# EAGLE design rfid_module (EAGLE 6.1)
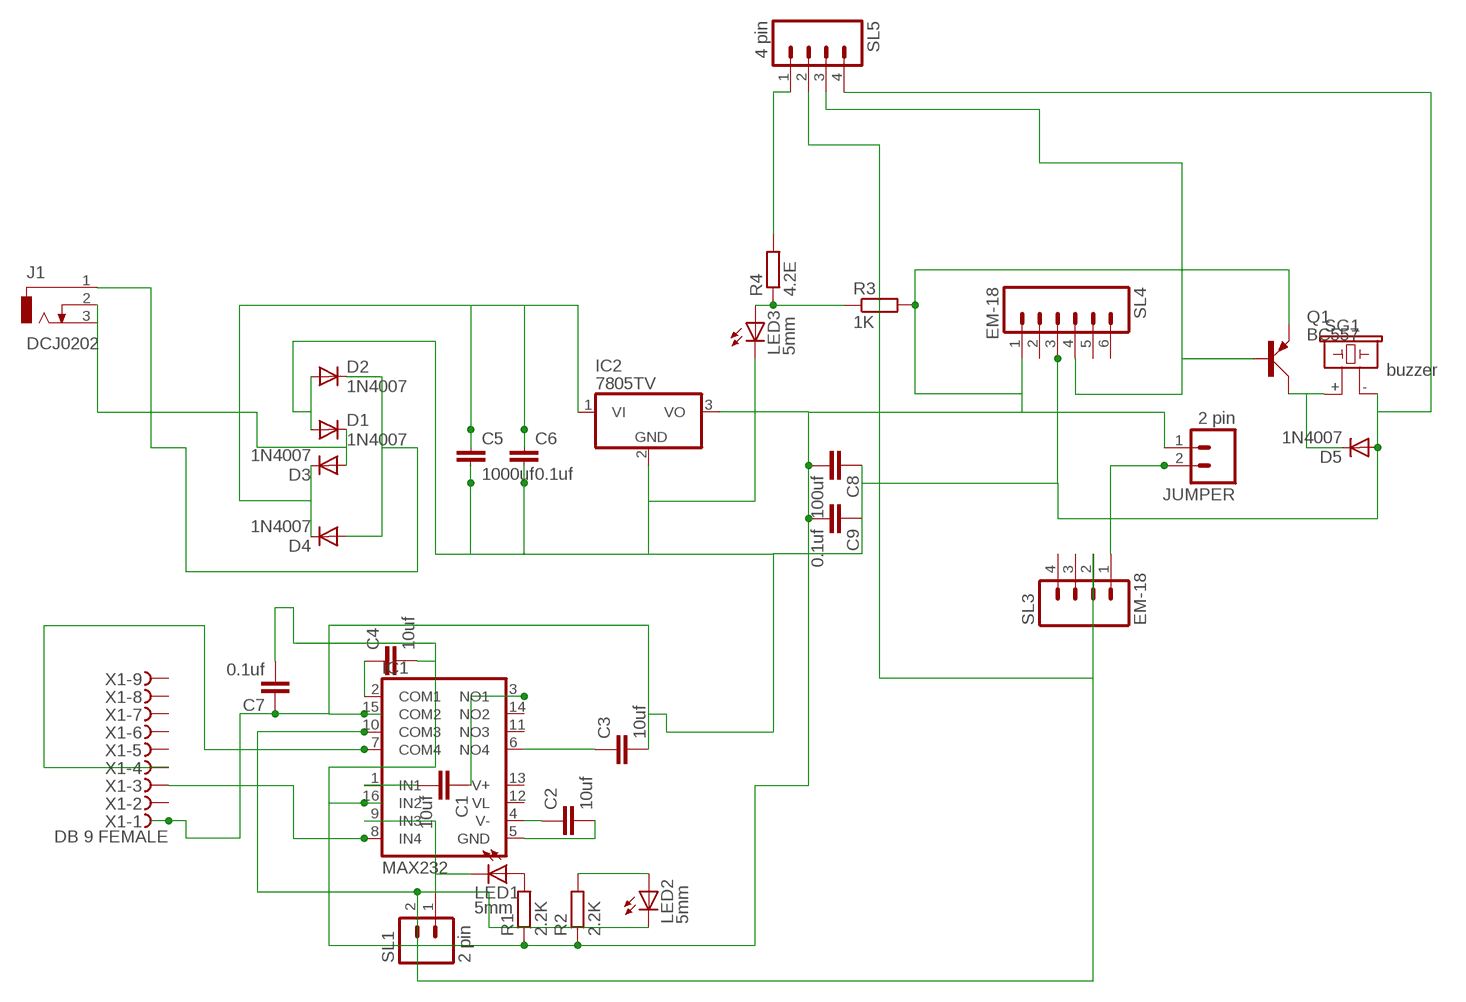
[diagram p0: schematic, sheet 1]

## Parts
C1  10uf  C2,5-3  [C2.5-3]
C2  10uf  C2,5-3  [C2.5-3]
C3  10uf  C2,5-3  [C2.5-3]
C4  10uf  C2,5-3  [C2.5-3]
C5  1000uf  C5/7.2  [C5B7.2]
C6  0.1uf  C2,5-3  [C2.5-3]
C7  0.1uf  C2,5-3  [C2.5-3]
C8  100uf  C2,5-3  [C2.5-3]
C9  0.1uf  C2,5-3  [C2.5-3]
D1  1N4007  1N4004  [DO41-10]
D2  1N4007  1N4004  [DO41-10]
D3  1N4007  1N4004  [DO41-10]
D4  1N4007  1N4004  [DO41-10]
D5  1N4007  1N4004  [DO41-10]
IC1  MAX232  MAX313EPE  [DIL16]
IC2  7805TV  [TO220V]
J1  DCJ0202  [DCJ0202]
JUMPER  2 pin  M02  [02P]
LED1  5mm  LED5MM  [LED5MM]
LED2  5mm  LED5MM  [LED5MM]
LED3  5mm  LED5MM  [LED5MM]
Q1  BC557  [SOT54A]
R1  2.2K  R-EU_0204/7  [0204/7]
R2  2.2K  R-EU_0204/7  [0204/7]
R3  1K  R-EU_0204/7  [0204/7]
R4  4.2E  R-EU_0204/7  [0204/7]
SG1  buzzer  F/CM12P  [F/CM12P]
SL1  2 pin  M02  [02P]
SL3  EM-18  M04  [04P]
SL4  EM-18  M06  [06P]
SL5  4 pin  M04  [04P]
X1  DB 9 FEMALE  D-SUB9-H2M09ST  [H2M09ST]

## Nets
N$1: C1.2 IC1.1(IN1)
N$2: C1.1 IC1.3(NO1)
N$3: C2.1 IC1.4(V-)
N$4: C2.2 IC1.5(GND)
N$5: C3.1 IC1.6(NO4)
N$6: C4.2 C7.2 C8.2 C9.2 IC1.16(IN2) IC2.3(VO) JUMPER.1 Q1.E R1.1 R2.1 R3.2 SL4.1
N$7: C4.1 IC1.2(COM1)
N$8: IC1.9(IN3) LED1.K(C) SL1.1
N$9: IC1.8(IN4) X1.3
N$10: IC1.7(COM4) X1.4
N$11: IC1.10(COM3) LED2.K(C) SL1.2 SL3.2 SL5.2
N$12: LED2.A R2.2
N$13: C3.2 C5.2 C6.2 C7.1 C8.1 C9.1 D1.A D2.A D5.A IC1.15(COM2) IC2.2(GND) LED3.K(C) SG1.- SL4.3 SL5.4 X1.1
N$14: C5.1 C6.1 D3.C D4.C IC2.1(VI)
N$15: D2.C D4.A J1.1
N$16: LED1.A R1.2
N$17: D5.C Q1.C SG1.+
N$18: D1.C D3.A J1.2 J1.3
N$19: Q1.B SL4.4 SL5.3
N$20: JUMPER.2 SL3.1
N$21: LED3.A R3.1 R4.1
N$22: R4.2 SL5.1
Unconnected: IC1.11(NO3) IC1.14(NO2) SL3.3 SL3.4 SL4.2 SL4.5 SL4.6 X1.2 X1.5 X1.6 X1.7 X1.8 X1.9

## Power pins joined to a net without a drawn wire
V+: IC1.13(V+)
VL: IC1.12(VL)

## Library data of the parts
C1-C9 = capacitor-wima:C: CAPACITOR naming: grid - package width
D1-D5 = diode:1N4004: DIODE general purpose rectifier, 1 A
IC1 = maxim:MAX313: 10?, Quad, SPST, CMOS Analog Switches Source: http://datasheets.maxim-ic.com/en/ds/MAX312-MAX314.pdf; MPN: MAX313EPE+; OC_FARNELL: unknown; OC_NEWARK: 99K3220
IC2 = linear:78*: Positive VOLTAGE REGULATOR Source: http://cache.national.com/ds/LM/LM78L05.pdf http://www.fairchildsemi.com/ds/LM/LM7805.pdf
J1 = con-jack:DCJ0202: DC POWER JACK Source: DCJ0202.pdf; OC_FARNELL: unknown; OC_NEWARK: unknown
JUMPER SL1 = con-amp-quick:M02: AMP QUICK CONNECTOR; OC_FARNELL: unknown; OC_NEWARK: unknown
LED1-LED3 = led:LED: LED OSRAM: - CHIPLED LG R971, LG N971, LY N971, LG Q971, LY Q971, LO R971, LY R971 LH N974, LH R974 LS Q976, LO Q976, LY Q976 LO Q996 - Hyper CHIPLED LW Q18S LB Q993, LB Q99A, LB R99A - SideLED LS A670, LO A670, LY A670, LG A670, LP A670 LB A673, LV A673, LT A673, LW A673 LH A674 LY A675 LS A676, LA A676, LO A676, LY A676, LW A676 LS A679, LY A679, LG A679 - Hyper Micro SIDELED® LS Y876, LA Y876, LO Y876, LY Y876 LT Y87S - SmartLED LW L88C, LW L88S LB L89C, LB L89S, LG L890 LS L89K, LO L89K, LY L89K LS L896, LA L896, LO L896, LY L896 - TOPLED LS T670, LO T670, LY T670, LG T670, LP T670 LSG T670, LSP T670, LSY T670, LOP T670, LYG T670 LG T671, LOG T671, LSG T671 LB T673, LV T673, LT T673, LW T673 LH T674 LS T676, LA T676, LO T676, LY T676, LB T676, LH T676, LSB T676, LW T676 LB T67C, LV T67C, LT T67C, LS T67K, LO T67K, LY T67K, LW E67C LS E67B, LA E67B, LO E67B, LY E67B, LB E67C, LV E67C, LT E67C LW T67C LS T679, LY T679, LG T679 LS T770, LO T770, LY T770, LG T770, LP T770 LB T773, LV T773, LT T773, LW T773 LH T774 LS E675, LA E675, LY E675, LS T675 LS T776, LA T776, LO T776, LY T776, LB T776 LHGB T686 LT T68C, LB T68C - Hyper Mini TOPLED® LB M676 - Mini TOPLED Santana® LG M470 LS M47K, LO M47K, LY M47K Source: http://www.osram.convergy.de LUXEON: - LUMILED® LXK2-PW12-R00, LXK2-PW12-S00, LXK2-PW14-U00, LXK2-PW14-V00 LXK2-PM12-R00, LXK2-PM12-S00, LXK2-PM14-U00 LXK2-PE12-Q00, LXK2-PE12-R00, LXK2-PE12-S00, LXK2-PE14-T00, LXK2-PE14-U00 LXK2-PB12-K00, LXK2-PB12-L00, LXK2-PB12-M00, LXK2-PB14-N00, LXK2-PB14-P00, LXK2-PB14-Q00 LXK2-PR12-L00, LXK2-PR12-M00, LXK2-PR14-Q00, LXK2-PR14-R00 LXK2-PD12-Q00, LXK2-PD12-R00, LXK2-PD12-S00 LXK2-PH12-R00, LXK2-PH12-S00 LXK2-PL12-P00, LXK2-PL12-Q00, LXK2-PL12-R00 Source: www.luxeon.com KINGBRIGHT: KA-3528ASYC Source: www.kingbright.com
Q1 = transistor-small-signal:BC557: PNP TRANSISTOR
R1-R4 = rcl:R-EU_: RESISTOR, European symbol
SG1 = buzzer:F/CM12P: BUZZER Source: Buerklin; OC_FARNELL: unknown; OC_NEWARK: unknown
SL3 SL5 = con-amp-quick:M04: AMP QUICK CONNECTOR; OC_FARNELL: unknown; OC_NEWARK: unknown
SL4 = con-amp-quick:M06: AMP QUICK CONNECTOR; OC_FARNELL: unknown; OC_NEWARK: unknown
X1 = con-thomas-betts:D-SUB9-: D-Subminiatur Connector Source: Electronioc Interconnects European Edition 1998; OC_FARNELL: unknown; OC_NEWARK: unknown

## Board
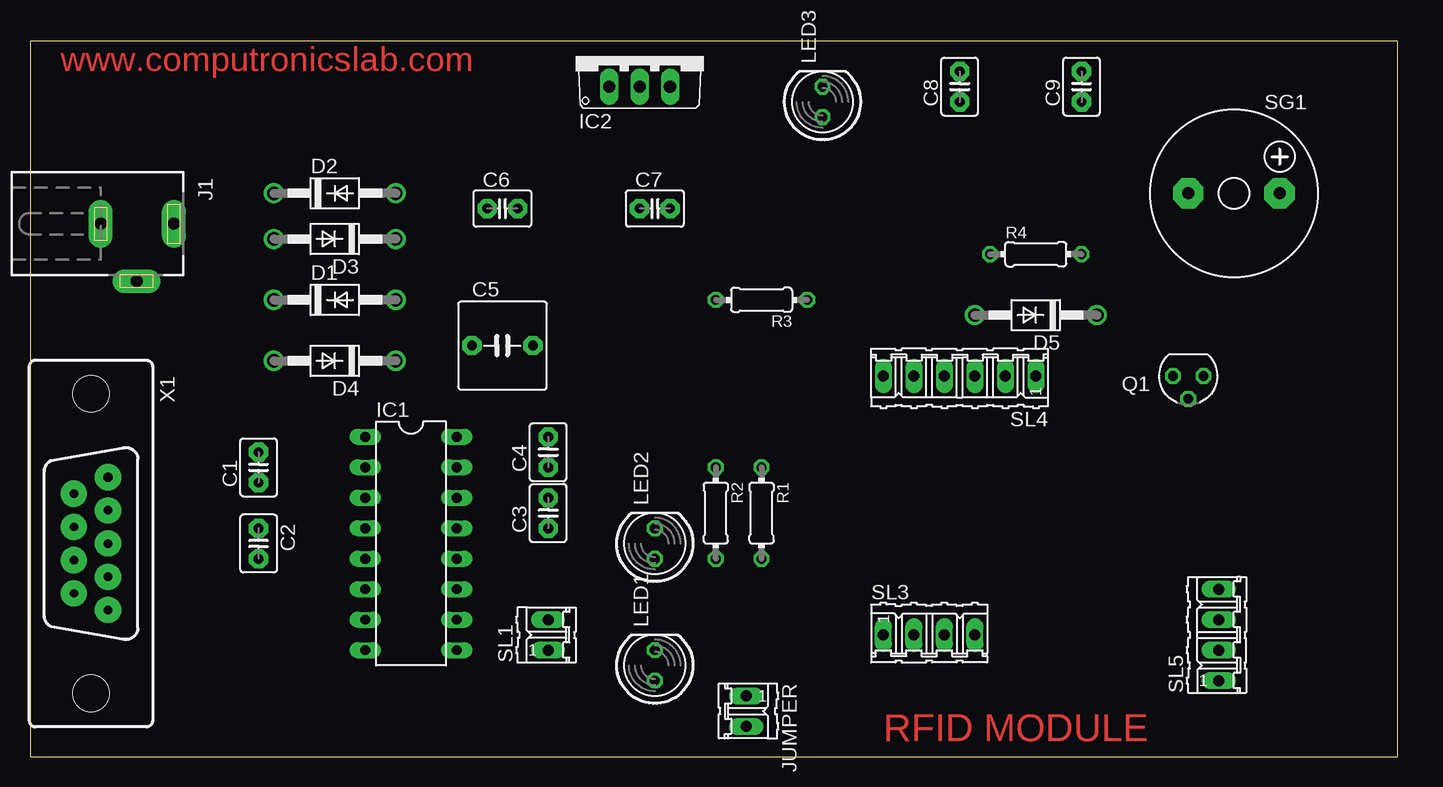
[diagram p1: board, top side]
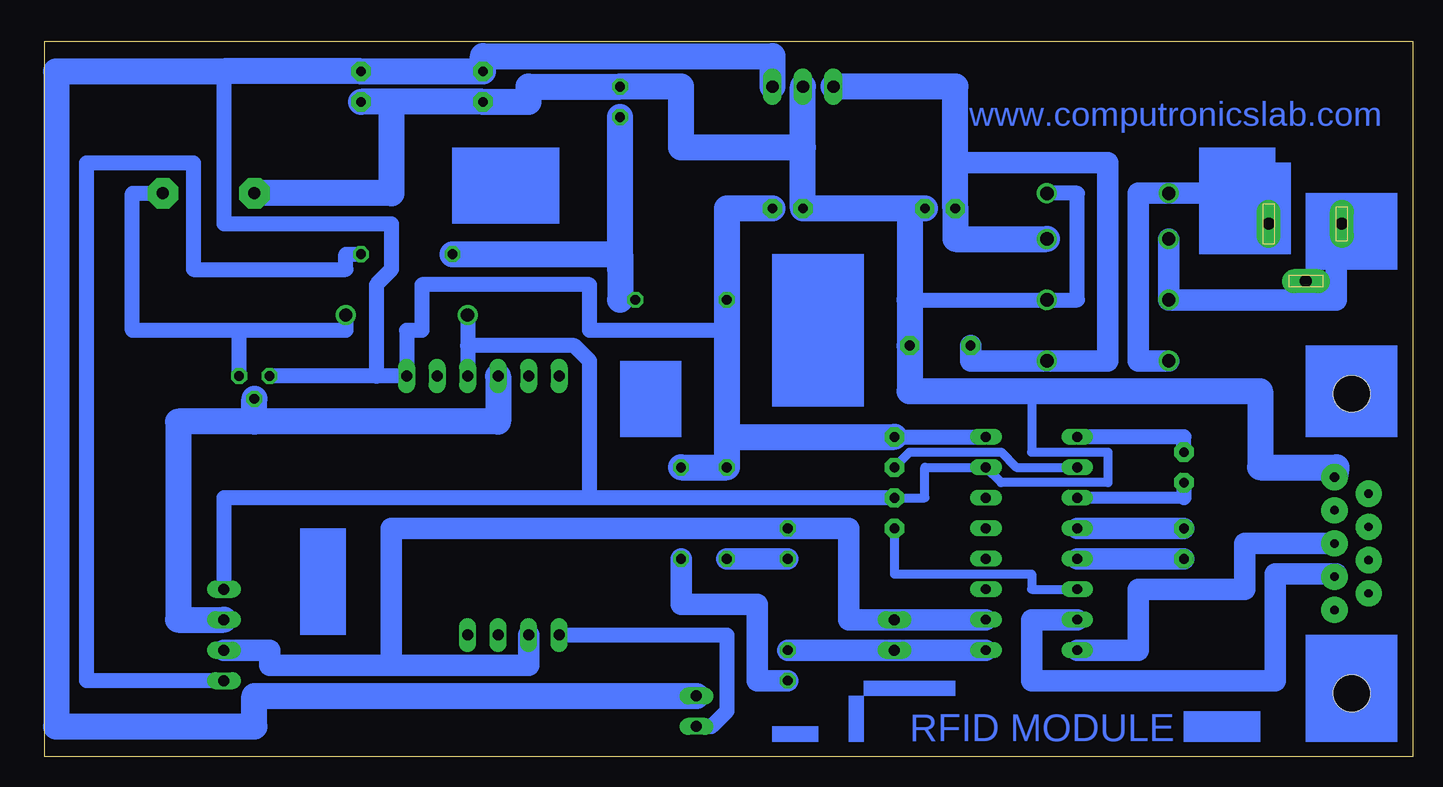
[diagram p2: board, bottom side, seen from below]

Size 113.97 x 59.68 mm. Coordinates in mm from the lower left corner, seen from the top.
Outline: 0,0 113.97,0 113.97,59.68 0,59.68 0,0
Copper layers (1*16): Top 0.035mm / dielectric 1.5mm / Bottom 0.035mm
Design rules: minimum track width 30mil, minimum drill 24mil, track to track 8mil, track to pad 8mil, pad to pad 8mil, via to via 8mil, smd to smd 8mil, copper to edge 40mil, drill to drill 8mil, minimum pad ring 10mil, minimum via ring 8mil, stop-mask expansion 4mil, vias tented up to drill 0mil, thermal gap 10mil

### Footprints (pad centres in the part's own frame; a part is rotated, then mirrored left to right if it is on the bottom)
C2.5-3 = drill 0.813 pad 1.6 octagon: 1 -1.27,0; 2 1.27,0
C5B7.2 = drill 0.813 pad 1.6 octagon: 1 -2.54,0; 2 2.54,0
DO41-10 = drill 1.118: A 5.08,0; C -5.08,0
DIL16 = drill 0.813 long: 1 -8.89,-3.81; 2 -6.35,-3.81; 3 -3.81,-3.81; 4 -1.27,-3.81; 5 1.27,-3.81; 6 3.81,-3.81; 7 6.35,-3.81; 8 8.89,-3.81; 9 8.89,3.81; 10 6.35,3.81; 11 3.81,3.81; 12 1.27,3.81; 13 -1.27,3.81; 14 -3.81,3.81; 15 -6.35,3.81; 16 -8.89,3.81
TO220V = drill 1.016 long: 1 -2.54,-2.54; 2 0,-2.54; 3 2.54,-2.54
DCJ0202 = drill 1 pad 2 long: 1 0,3.1; 2 4.8,0; 3 0,-3
02P = drill 0.914 long: 1 -1.27,0; 2 1.27,0
LED5MM = drill 0.813 octagon: A -1.27,0; K 1.27,0
SOT54A = drill 0.813 octagon: B 0,1.905; C -1.27,0; E 1.27,0
0204/7 = drill 0.813 octagon: 1 -3.81,0; 2 3.81,0
F/CM12P = drill 1.016 pad 2.54 octagon: + 3.81,0; - -3.81,0
04P = drill 0.914 long: 1 -3.81,0; 2 -1.27,0; 3 1.27,0; 4 3.81,0
06P = drill 0.914 long: 1 -6.35,0; 2 -3.81,0; 3 -1.27,0; 4 1.27,0; 5 3.81,0; 6 6.35,0
H2M09ST = drill 0.8 pad 2.184: 1 -5.537,1.422 | drill 0.7 pad 2.184: 2 -2.769,1.422; 3 0,1.422; 4 2.769,1.422; 5 5.537,1.422; 6 -4.153,-1.422; 7 -1.384,-1.422; 8 1.384,-1.422; 9 4.153,-1.422 | hole 3.048: -12.497,0; 12.497,0

### Placement (x,y rotation side)
C1  19.05,24.13 90 top
C2  19.05,17.78 270 top
C3  43.18,20.32 90 top
C4  43.18,25.4 90 top
C5  39.37,34.29 0 top
C6  39.37,45.72 0 top
C7  52.07,45.72 0 top
C8  77.47,55.88 90 top
C9  87.63,55.88 90 top
D1  25.4,38.1 0 top
D2  25.4,46.99 0 top
D3  25.4,43.18 180 top
D4  25.4,33.02 180 top
D5  83.82,36.83 180 top
IC1  31.75,17.78 270 top
IC2  50.8,58.42 0 top
J1  8.89,44.45 270 top
JUMPER  59.69,3.81 270 top
LED1  52.07,7.62 90 top
LED2  52.07,17.78 90 top
LED3  66.04,54.61 90 top
Q1  96.52,31.75 180 top
R1  60.96,20.32 270 top
R2  57.15,20.32 270 top
R3  60.96,38.1 180 top
R4  83.82,41.91 0 top
SG1  100.33,46.99 0 top
SL1  43.18,10.16 90 top
SL3  74.93,10.16 0 top
SL4  77.47,31.75 180 top
SL5  99.06,10.16 90 top
X1  5.08,17.78 270 top

### Tracks (layer width: path | path; a pad name or v marks a point on that pad's centre or on a via)
N$1
  Bottom 1.27: IC1.1 19.05,26.67 C1.2
N$2
  Bottom 1.016: 19.05,21.59 IC1.3
  Bottom 1.27: C1.1 19.05,21.59
N$3
  Bottom 1.778: C2.1 IC1.4
N$4
  Bottom 1.778: C2.2 IC1.5
N$5
  Bottom 0.762: IC1.6 31.75,13.97 31.75,15.24 43.18,15.24 43.18,16.51 C3.1
N$6
  Bottom 1.27: 86.36,31.75 SL4.1 83.82,35.56 82.55,35.56 82.55,39.37 68.58,39.37 68.58,35.56 57.15,35.56 | 86.36,31.75 Q1.E | C4.2 IC1.16 | 86.36,31.75 86.36,39.37 85.09,40.64 85.09,44.45 99.06,44.45 99.06,57.15
  Bottom 2.184: R1.1 R2.1 57.15,26.67 | C7.2 57.15,45.72 R3.2 57.15,35.56 57.15,26.67 | 57.15,26.67 C4.2 | IC2.3 53.34,58.42 77.47,58.42 C8.2 C9.2 99.06,57.15 113.03,57.15 113.03,2.54 96.52,2.54 96.52,5.08 JUMPER.1
N$7
  Bottom 0.762: IC1.2 33.02,24.13 34.29,25.4 41.91,25.4 C4.1
N$8
  Bottom 1.778: IC1.9 SL1.1 LED1.K
N$9
  Bottom 1.778: IC1.8 22.86,8.89 22.86,13.97 15.24,13.97 13.97,13.97 13.97,17.78 11.43,17.78 X1.3
N$10
  Bottom 0.762: 6.35,15.24 X1.4
  Bottom 1.778: IC1.7 31.75,11.43 31.75,6.35 11.43,6.35 11.43,15.24 6.35,15.24
N$11
  Bottom 1.778: IC1.10 SL1.2 46.99,11.43 46.99,19.05 LED2.K 85.09,19.05 85.09,7.62 | SL3.2 73.66,7.62 85.09,7.62 | SL5.2 95.25,8.89 95.25,7.62 85.09,7.62
N$12
  Bottom 1.778: R2.2 LED2.A
N$13
  Bottom 0.762: C3.2 40.64,21.59 40.64,24.13 IC1.15 34.29,22.86 25.4,22.86 25.4,25.4 31.75,25.4 31.75,30.48
  Bottom 1.27: D5.A 78.74,34.29 | 78.74,34.29 SL4.3 | SL5.4 99.06,21.59 68.58,21.59 | C3.2 68.58,21.59 | 78.74,34.29 69.85,34.29 68.58,33.02 68.58,21.59 | 41.91,38.1 D1.A 27.94,38.1 27.94,46.99 D2.A
  Bottom 2.184: 85.09,54.61 C8.1 73.66,54.61 73.66,55.88 LED3.K 60.96,55.88 60.96,50.8 50.8,50.8 | 85.09,54.61 C9.1 | 85.09,54.61 85.09,46.99 SG1.- | 50.8,50.8 C7.1 41.91,45.72 | 50.8,50.8 IC2.2 | 41.91,45.72 41.91,38.1 C5.2 41.91,30.48 31.75,30.48 12.7,30.48 12.7,24.13 6.35,24.13 X1.1 | C6.2 41.91,45.72
N$14
  Bottom 1.778: C5.1 36.83,33.02 D4.C 25.4,33.02 25.4,49.53 38.1,49.53
  Bottom 2.184: IC2.1 38.1,55.88 38.1,49.53 C6.1 38.1,43.18 D3.C
N$15
  Bottom 0.762: 12.7,44.45 J1.1
  Bottom 1.778: D4.A 22.86,33.02 22.86,46.99 D2.C 12.7,46.99 12.7,44.45
N$16
  Bottom 1.778: LED1.A 54.61,6.35 54.61,12.7 60.96,12.7 R1.2
N$17
  Bottom 1.27: D5.C 88.9,35.56 92.71,35.56 97.79,35.56 | 97.79,35.56 106.68,35.56 106.68,46.99 SG1.+ | Q1.C 97.79,35.56
N$18
  Bottom 0.762: 6.35,44.45 J1.3
  Bottom 1.27: 8.89,38.1 J1.2
  Bottom 1.778: D3.A D1.C 8.89,38.1 6.35,38.1 6.35,44.45
N$19
  Bottom 2.184: 96.52,27.94 76.2,27.94 SL4.4 | SL5.3 102.87,11.43 102.87,27.94 96.52,27.94 | 96.52,27.94 Q1.B
N$20
  Bottom 0.762: 58.42,2.54 JUMPER.2
  Bottom 1.27: 58.42,2.54 57.15,3.81 57.15,10.16 SL3.1
N$21
  Bottom 0.762: 66.04,38.1 R3.1
  Bottom 2.184: 66.04,38.1 66.04,40.64 66.04,41.91 | R4.1 66.04,41.91 | 66.04,41.91 LED3.A
N$22
  Bottom 1.27: R4.2 88.9,41.91 88.9,40.64 101.6,40.64 101.6,49.53 110.49,49.53 110.49,6.35 SL5.1
(copper drawn outside any net)
  shapes: Bottom area x13

### Text on the board
Top: www.computronicslab.com | RFID MODULE
Bottom: www.computronicslab.com | RFID MODULE